# EAGLE design dual power  board (EAGLE 9.6.2)
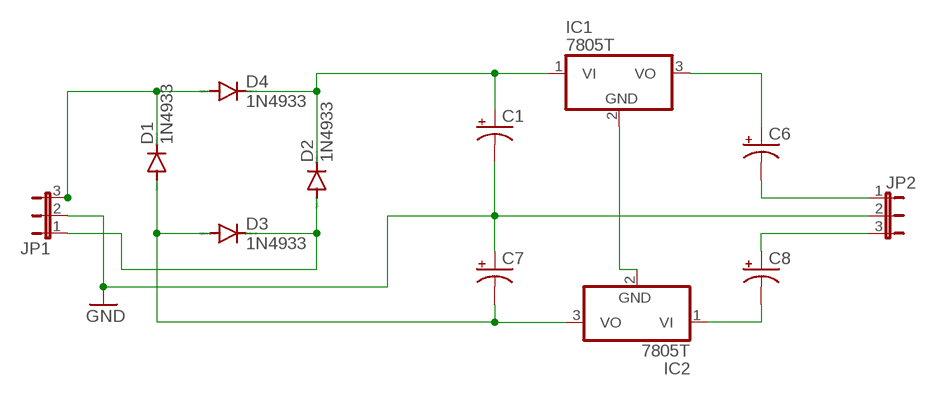
[diagram p0: schematic, sheet 1]

## Parts
C1  CPOL-USE5-5  [E5-5]
C6  CPOL-USE5-5  [E5-5]
C7  CPOL-USE5-5  [E5-5]
C8  CPOL-USE5-5  [E5-5]
D1  1N4933  [DO41-10]
D2  1N4933  [DO41-10]
D3  1N4933  [DO41-10]
D4  1N4933  [DO41-10]
IC1  7805T  [TO220H]
IC2  7805T  [TO220H]
JP1  JP2E  [JP2]
JP2  JP2E  [JP2]

## Nets
N$1: D1.C D4.A JP1.3
N$2: C6.- JP2.1
N$3: D2.A D3.C JP1.1
N$5: C8.+ JP2.3
N$6: C1.+ D2.C D4.C IC1.1(VI)
N$7: C6.+ IC1.3(VO)
N$8: IC1.2(GND) IC2.2(GND)
N$9: C1.- C7.+ JP1.2 JP2.2 ; supply symbol labelled GND
N$10: C8.- IC2.1(VI)
N$11: C7.- D1.A D3.A IC2.3(VO)

## Library data of the parts
C1 C6-C8 = rcl:CPOL-US: POLARIZED CAPACITOR, American symbol; SPICEPREFIX: C
D1-D4 = diode:1N4933: DIODE fast recovery rectifier, 1A
IC1 IC2 = linear:78*: Positive VOLTAGE REGULATOR Source: http://cache.national.com/ds/LM/LM78L05.pdf http://www.fairchildsemi.com/ds/LM/LM7805.pdf
JP1 JP2 = jumper:JP2E: JUMPER

## Board
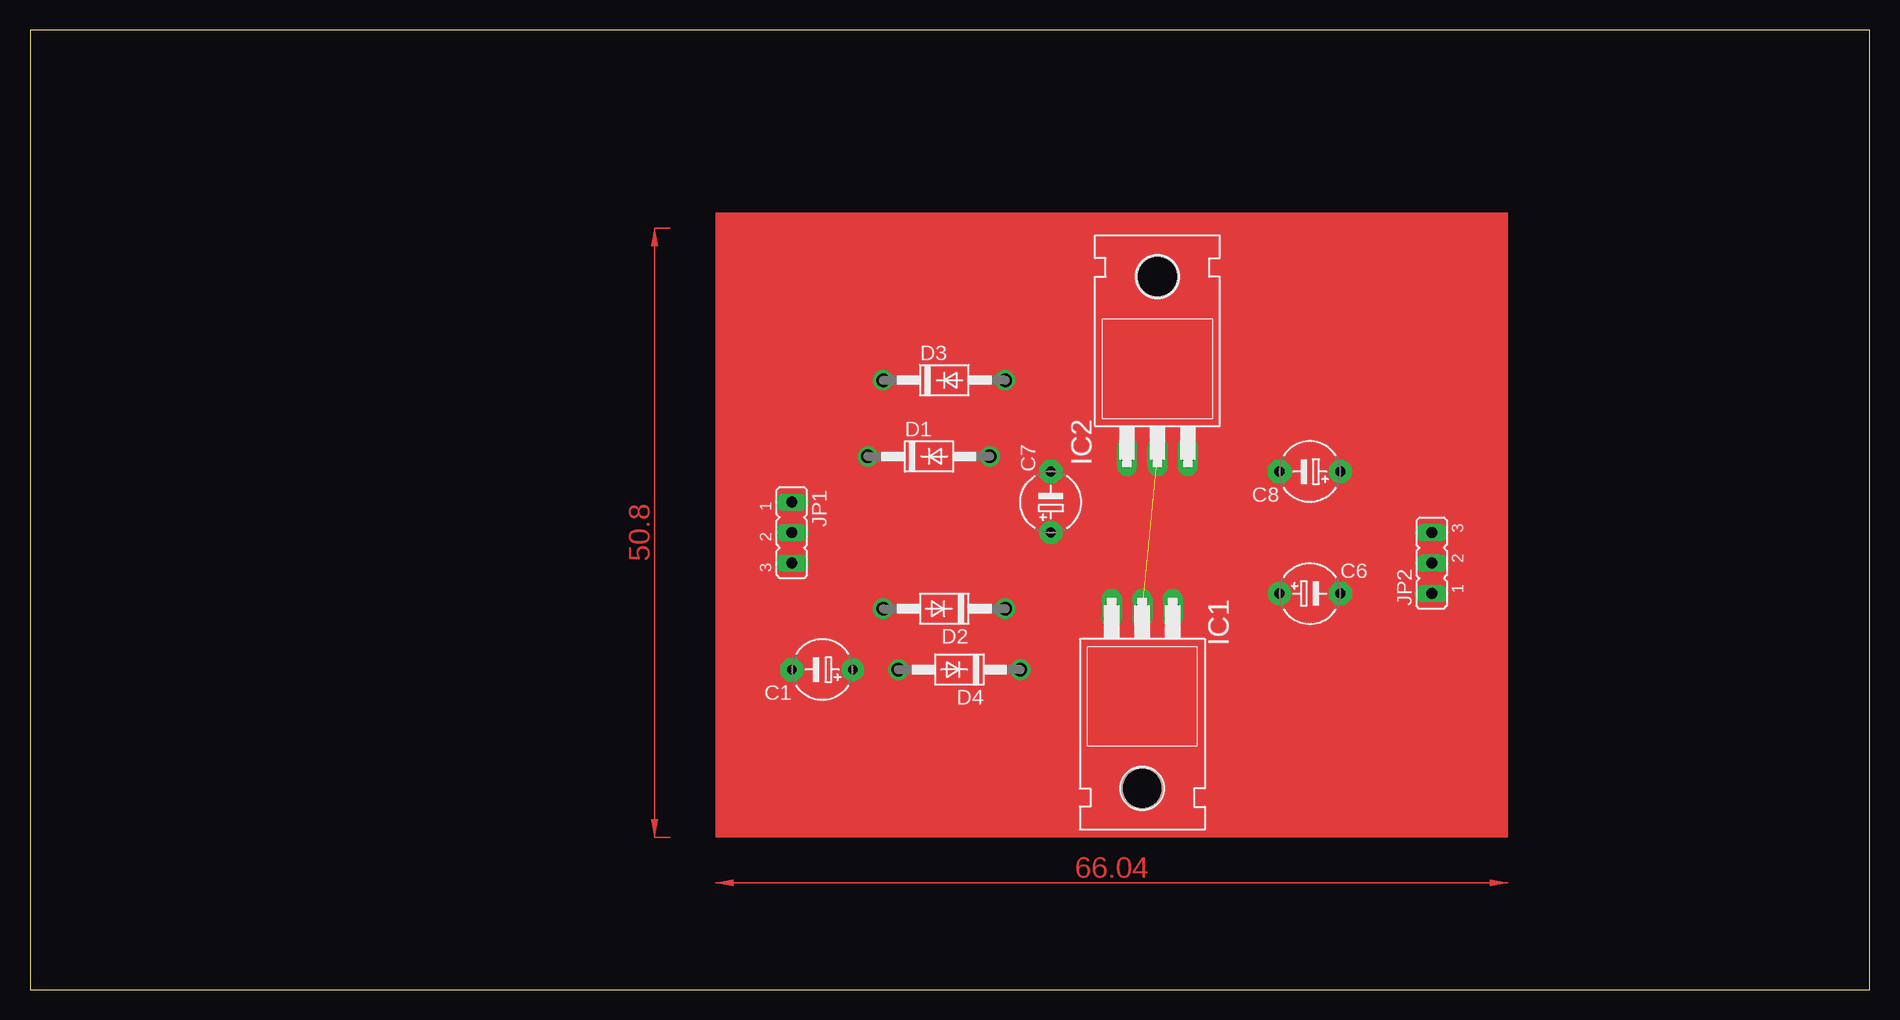
[diagram p1: board, top side]
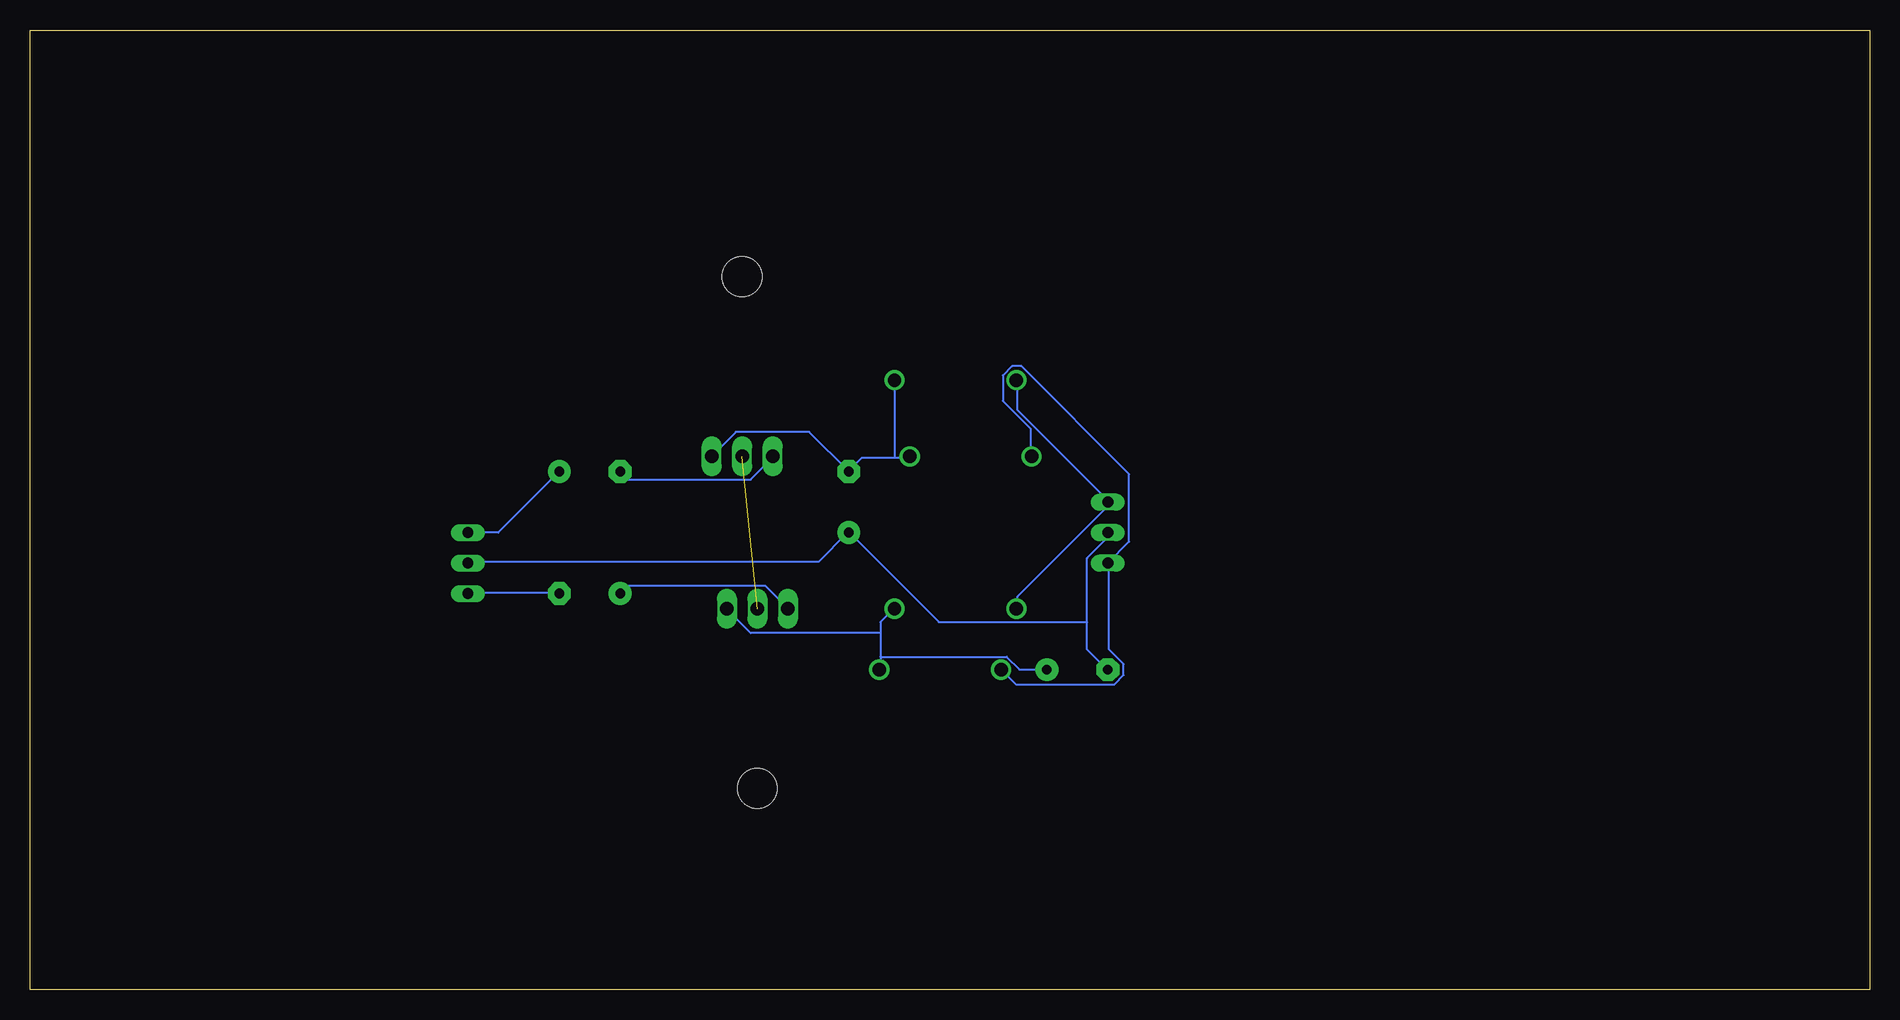
[diagram p2: board, bottom side, seen from below]

Size 153.34 x 80 mm. Coordinates in mm from the lower left corner, seen from the top.
Outline: 0,0 153.34,0 153.34,80 0,80 0,0
Copper layers (1*16): Top 0.035mm / dielectric 1.5mm / Bottom 0.035mm
Design rules "default": minimum track width 6mil, minimum drill 0.35mm, track to track 6mil, track to pad 6mil, pad to pad 6mil, via to via 6mil, smd to smd 6mil, copper to edge 40mil, drill to drill 6mil, minimum pad ring 10mil, minimum via ring 8mil, stop-mask expansion 4mil, vias tented up to drill 0mil, thermal gap 10mil

### Footprints (pad centres in the part's own frame; a part is rotated, then mirrored left to right if it is on the bottom)
E5-5 = drill 0.813 pad 1.905: + -2.54,0 | drill 0.813 pad 1.905 octagon: - 2.54,0
DO41-10 = drill 1.118: A 5.08,0; C -5.08,0
TO220H = drill 1.118 long: 1 -2.54,-10.16; 2 0,-10.16; 3 2.54,-10.16 | hole 3.302: 0,4.826
JP2 = drill 0.914 long: 1 -2.54,0; 2 0,0; 3 2.54,0

### Placement (x,y rotation side)
C1  66.04,26.67 180 top
C6  106.68,33.02 0 top
C7  85.09,40.64 90 top
C8  106.68,43.18 180 top
D1  74.93,44.45 0 top
D2  76.2,31.75 180 top
D3  76.2,50.8 0 top
D4  77.47,26.67 180 top
IC1  92.71,21.59 180 top
IC2  93.98,54.61 0 top
JP1  63.5,38.1 270 top
JP2  116.84,35.56 90 top

### Tracks (layer width: path | path; a pad name or v marks a point on that pad's centre or on a via)
N$1
  Bottom 0.152: D4.A 71.17,25.45 62.94,25.45 62.18,26.21 62.18,27.13 63.4,28.35 63.4,35.51 JP1.3 61.72,37.34 61.72,42.98 70.71,51.97 71.48,51.97 72.24,51.21 72.24,49.07 69.95,46.79 69.95,44.5 D1.C
N$2
  Bottom 0.152: JP2.1 116.74,33.07 109.27,33.07 C6.-
N$3
  Bottom 0.152: D2.A 71.02,31.85 71.02,32.77 63.55,40.23 63.55,40.54 JP1.1 63.4,40.69 71.02,48.31 71.02,50.75 D3.C
N$5
  Bottom 0.152: JP2.3 114.3,38.1 C8.+
N$6
  Bottom 0.152: 82.45,29.72 82.45,30.63 81.38,31.7 D2.C | 82.45,29.72 82.45,27.74 | 82.45,27.74 82.45,26.67 D4.C | 82.45,29.72 93.27,29.72 95.25,31.7 IC1.1 | C1.+ 70.87,26.67 71.93,27.74 82.45,27.74
N$7
  Bottom 0.152: C6.+ 103.48,33.68 92.05,33.68 90.22,31.85 IC1.3
N$8  (1 unrouted)
N$9
  Bottom 0.152: 65.23,30.63 65.23,28.35 63.55,26.67 C1.- | 65.23,30.63 65.23,35.97 63.55,37.64 63.55,38.1 JP1.2 | JP2.2 116.74,35.66 87.63,35.66 85.19,38.1 C7.+ 85.04,38.1 77.57,30.63 65.23,30.63
N$10
  Bottom 0.152: C8.- 103.48,42.52 93.27,42.52 91.44,44.35 IC2.1
N$11
  Bottom 0.152: 81.23,44.35 83.97,44.35 85.04,43.28 C7.- 88.39,46.48 94.49,46.48 IC2.3 | 81.23,44.35 80.01,44.35 D1.A | 81.23,44.35 81.23,50.75 D3.A
(copper drawn outside any net)
  shapes: Top area x3